# EAGLE design parrot_v2 (EAGLE 9.6.2)
CNAME: Parrot Teensy Board; CREVISION: 1.0; DESIGNER: Nathan Villicana-Shaw
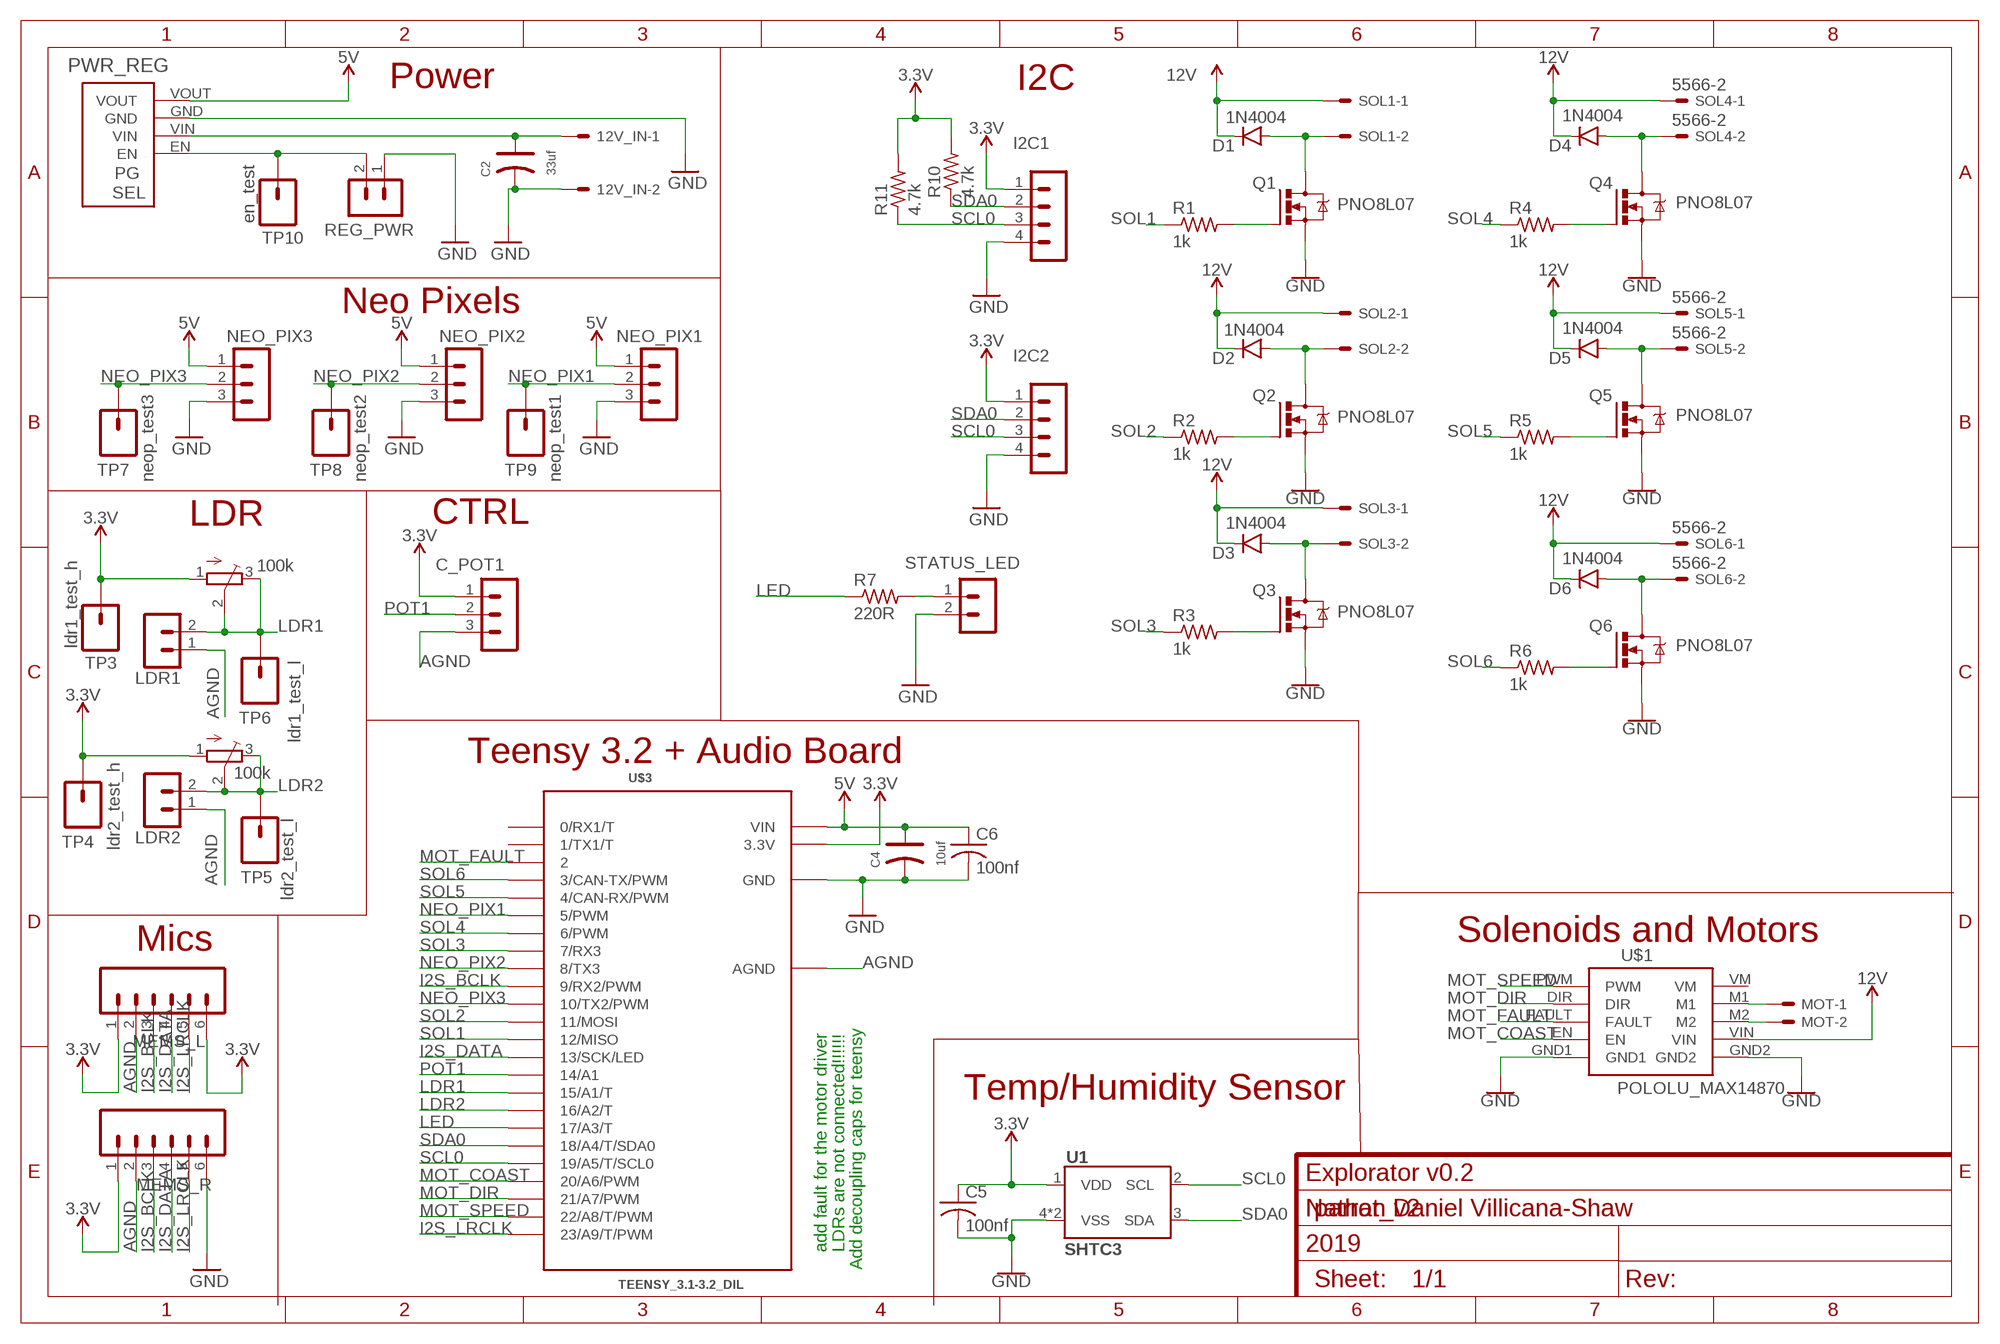
[diagram p0: schematic, sheet 1]

## Parts
12V_IN  5566-2  [5566-2]
C2  33uf  DIP-ALUMINUM-47UF-16V(D5-H7MM)  [PC-D5.3MM]
C4  10uf  DIP-ALUMINUM-47UF-16V(D5-H7MM)  [PC-D5.3MM]
C5  100nf  C-USC2012  [C2012]
C6  100nf  C-USC2012  [C2012]
C_POT1  B3B-PH-K  [B3B-PH-K]
D1  1N4004  DIODEPTH  [DIODE-1N4001]
D2  1N4004  DIODEPTH  [DIODE-1N4001]
D3  1N4004  DIODEPTH  [DIODE-1N4001]
D4  1N4004  DIODEPTH  [DIODE-1N4001]
D5  1N4004  DIODEPTH  [DIODE-1N4001]
D6  1N4004  DIODEPTH  [DIODE-1N4001]
I2C1  B4B-PH-K  [B4B-PH-K]
I2C2  B4B-PH-K  [B4B-PH-K]
LDR1  B2B-PH-K  [B2B-PH-K]
LDR2  B2B-PH-K  [B2B-PH-K]
MEMS_L  CONN_06POLAR  [MOLEX-1X6]
MEMS_R  CONN_06POLAR  [MOLEX-1X6]
MOT  5566-2  [5566-2]
NEO_PIX1  B3B-PH-K  [B3B-PH-K]
NEO_PIX2  B3B-PH-K  [B3B-PH-K]
NEO_PIX3  B3B-PH-K  [B3B-PH-K]
PWR_REG  S9V11F5S6CMA_MISSINIG_PINS  [S9V11F3S5CMA_MISSING_PINS]
Q1  PNO8L07  IRF540  [TO220BV]
Q2  PNO8L07  IRF540  [TO220BV]
Q3  PNO8L07  IRF540  [TO220BV]
Q4  PNO8L07  IRF540  [TO220BV]
Q5  PNO8L07  IRF540  [TO220BV]
Q6  PNO8L07  IRF540  [TO220BV]
R1  1k  R-US_M1206  [M1206]
R2  1k  R-US_M1206  [M1206]
R3  1k  R-US_M1206  [M1206]
R4  1k  R-US_M1206  [M1206]
R5  1k  R-US_M1206  [M1206]
R6  1k  R-US_M1206  [M1206]
R7  220R  R-US_M1206  [M1206]
R10  4.7k  R-US_M1206  [M1206]
R11  4.7k  R-US_M1206  [M1206]
REG_PWR  B2B-PH-K  [B2B-PH-K]
SOL1  5566-2  [5566-2]
SOL2  5566-2  [5566-2]
SOL3  5566-2  [5566-2]
SOL4  5566-2  [5566-2]
SOL5  5566-2  [5566-2]
SOL6  5566-2  [5566-2]
STATUS_LED  B2B-PH-K  [B2B-PH-K]
TM1  100k  TRIMPOTTC33X  [TC33X]
TM2  100k  TRIMPOTTC33X  [TC33X]
TP3  ldr1_test_h  CONN_01  [1X01]
TP4  ldr2_test_h  CONN_01  [1X01]
TP5  ldr2_test_l  CONN_01  [1X01]
TP6  ldr1_test_l  CONN_01  [1X01]
TP7  neop_test3  CONN_01  [1X01]
TP8  neop_test2  CONN_01  [1X01]
TP9  neop_test1  CONN_01  [1X01]
TP10  en_test  CONN_01  [1X01]
U1  SHTC3  [SHTC3]
U$1  POLOLU_MAX14870  [POLOLU_MAX14870]
U$3  TEENSY_3.1-3.2_DIL  [TEENSY_3.0-3.2&LC_DIL]

## Nets
3.3V [3.3V]: C5.1 C_POT1.1 I2C1.1 I2C2.1 MEMS_L.1 MEMS_L.6 MEMS_R.1 R10.2 R11.2 TM1.1(A) TM2.1(A) TP3.1 TP4.1 U1.1(VDD) U$3.3.3V
5V: C4.+ C6.1 NEO_PIX1.1 NEO_PIX2.1 NEO_PIX3.1 PWR_REG.VOUT U$3.VIN
12V [12V_IN]: 12V_IN.1 C2.+ D1.C D2.C D3.C D4.C D5.C D6.C PWR_REG.VIN SOL1.1 SOL2.1 SOL3.1 SOL4.1 SOL5.1 SOL6.1 U$1.VIN
AGND: C_POT1.3 LDR1.1 LDR2.1 MEMS_L.2 MEMS_R.2 U$3.AGND
GND: 12V_IN.2 C2.- C4.- C5.2 C6.2 I2C1.4 I2C2.4 MEMS_R.6 NEO_PIX1.3 NEO_PIX2.3 NEO_PIX3.3 PWR_REG.GND Q1.S Q2.S Q3.S Q4.S Q5.S Q6.S REG_PWR.1 STATUS_LED.2 U1.4(VSS) U1.5(VSS) U$1.GND1 U$1.GND2 U$3.GND
I2S_BCLK: MEMS_L.3 MEMS_R.3 U$3.9(9/RX2/PWM)
I2S_DATA: MEMS_L.4 MEMS_R.4 U$3.13(13/SCK/LED)
I2S_LRCLK: MEMS_L.5 MEMS_R.5 U$3.23/A9(23/A9/T/PWM)
LDR1: LDR1.2 TM1.2(S) TM1.3(E) TP6.1 U$3.15/A1(15/A1/T)
LDR2: LDR2.2 TM2.2(S) TM2.3(E) TP5.1 U$3.16/A2(16/A2/T)
LED: R7.1 U$3.17/A3(17/A3/T)
MOT_COAST: U$1.EN U$3.20/A6(20/A6/PWM)
MOT_DIR: U$1.DIR U$3.21/A7(21/A7/PWM)
MOT_FAULT: U$1.FAULT U$3.2
MOT_SPEED: U$1.PWM U$3.22/A8(22/A8/T/PWM)
N$1: Q5.G R5.2
N$2: D5.A Q5.D SOL5.2
N$4: Q6.G R6.2
N$5: Q2.G R2.2
N$6: D6.A Q6.D SOL6.2
N$7: R7.2 STATUS_LED.1
N$8: D2.A Q2.D SOL2.2
N$10: PWR_REG.EN REG_PWR.2 TP10.1
N$11: Q3.G R3.2
N$12: D3.A Q3.D SOL3.2
N$13: Q4.G R4.2
N$14: D4.A Q4.D SOL4.2
N$24: Q1.G R1.2
N$25: D1.A Q1.D SOL1.2
N$30: MOT.2 U$1.M2
N$31: MOT.1 U$1.M1
NEO_PIX1: NEO_PIX1.2 TP9.1 U$3.5(5/PWM)
NEO_PIX2: NEO_PIX2.2 TP8.1 U$3.8(8/TX3)
NEO_PIX3: NEO_PIX3.2 TP7.1 U$3.10(10/TX2/PWM)
POT1: C_POT1.2 U$3.14/A0(14/A1)
SCL0: I2C1.3 I2C2.3 R11.1 U1.2(SCL) U$3.19/A5(19/A5/T/SCL0)
SDA0: I2C1.2 I2C2.2 R10.1 U1.3(SDA) U$3.18/A4(18/A4/T/SDA0)
SOL1: R1.1 U$3.12(12/MISO)
SOL2: R2.1 U$3.11(11/MOSI)
SOL3: R3.1 U$3.7(7/RX3)
SOL4: R4.1 U$3.6(6/PWM)
SOL5: R5.1 U$3.4(4/CAN-RX/PWM)
SOL6: R6.1 U$3.3(3/CAN-TX/PWM)
Unconnected: U$1.VM U$3.0(0/RX1/T) U$3.1(1/TX1/T)

## Notes on the sheet
- Power | I2C
- Neo Pixels
- LDR | CTRL
- Teensy 3.2 + Audio Board
- Solenoids and Motors
- Mics
- Temp/Humidity Sensor
- Explorator v0.2
- Nathan Daniel Villicana-Shaw
- add fault for the motor driver | LDRs are not connected!!!!!! | 2019
- Add decoupling caps for teensy

## Library data of the parts
12V_IN MOT SOL1-SOL6 = con-molex:5566-2: Mini FIT connector 2 pol Source: http://www.molex.com; MF: MOLEX; OC_FARNELL: 1822072; OC_NEWARK: unknown
C2 C4 = Seeed-Capacitor:DIP-ALUMINUM-47UF-16V(D5-H7MM): 302030033; MPN: KS 100uF/16V; VALUE: 100uf
C5 C6 = adafruit:C-US: CAPACITOR, American symbol
C_POT1 NEO_PIX1-NEO_PIX3 = con-jst-ph:B3B-PH-K: HEADER
D1-D6 = SparkFun-DiscreteSemi:DIODE: Diode These are standard reverse protection diodes and small signal diodes. SMA package can handle up to about 1A. SOD-323 can handle about 200mA. What the SOD-323 package when ordering, there are some mfgs out there that are 5-pin packages.
I2C1 I2C2 = con-jst-ph:B4B-PH-K: HEADER
LDR1 LDR2 REG_PWR STATUS_LED = con-jst-ph:B2B-PH-K: HEADER
MEMS_L MEMS_R = SparkFun-Connectors:CONN_06: Multi connection point. Often used as Generic Header-pin footprint for 0.1 inch spaced/style header connections On any of the 0.1 inch spaced packages, you can populate with these: Break Away Headers - Straight <https://www.sparkfun.com/products/116> (PRT-00116) Break Away Male Headers - Right Angle <https://www.sparkfun.com/products/553> (PRT-00553) Female Headers <https://www.sparkfun.com/products/115> (PRT-00115) Break Away Headers - Machine Pin <https://www.sparkfun.com/products/117> (PRT-00117) Break Away Female Headers - Swiss Machine Pin <https://www.sparkfun.com/products/743> (PRT-00743) Arduino Stackable Header - 6 Pin <https://www.sparkfun.com/products/9280> (PRT-09280) For SCREWTERMINALS and SPRING TERMINALS visit here: Screw Terimnals on SparkFun.com <https://www.sparkfun.com/search/results?term=Screw+Terminals> (5mm/3.5mm/2.54mm spacing) This device is also useful as a general connection point to wire up your design to another part of your project. Our various solder wires solder well into these plated through hole pads. Hook-Up Wire - Assortment (Stranded, 22 AWG) <https://www.sparkfun.com/products/11375> (PRT-11375) Hook-Up Wire - Assortment (Solid Core, 22 AWG) <https://www.sparkfun.com/products/11367> (PRT-11367) View the entire wire category on our website here <https://www.sparkfun.com/categories/141>
PWR_REG = nathans-custom-parts:S9V11F5S6CMA_MISSINIG_PINS
Q1-Q6 = transistor-power:IRF540: HEXFET Power MOSFET
R1-R7 R10 R11 = adafruit:R-US_: RESISTOR, American symbol
TM1 TM2 = adafruit:TRIMPOT: SMT trimmer potentiometer part number TC33X http://www.ladyada.net/library/eagle
TP3-TP10 = SparkFun-Connectors:CONN_01: Single connection point. Often used as Generic Header-pin footprint for 0.1 inch spaced/style header connections On any of the 0.1 inch spaced packages, you can populate with these: Break Away Headers - Straight <https://www.sparkfun.com/products/116> (PRT-00116) Break Away Male Headers - Right Angle <https://www.sparkfun.com/products/553> (PRT-00553) Female Headers <https://www.sparkfun.com/products/115> (PRT-00115) Break Away Headers - Machine Pin <https://www.sparkfun.com/products/117> (PRT-00117) Break Away Female Headers - Swiss Machine Pin <https://www.sparkfun.com/products/743> (PRT-00743) This device is also useful as a general connection point to wire up your design to another part of your project. Our various solder wires solder well into these plated through hole pads. Hook-Up Wire - Assortment (Stranded, 22 AWG) <https://www.sparkfun.com/products/11375> (PRT-11375) Hook-Up Wire - Assortment (Solid Core, 22 AWG) <https://www.sparkfun.com/products/11367> (PRT-11367) View the entire wire category on our website here <https://www.sparkfun.com/categories/141> Special notes: SMTSO-256-ET is a "flush mount" nut for a 4-40 screw. We mostly use this on specialty testbeds; it is a nice way to connect hardware to your PCB at an adjustable hieght. Also note, the SNAP packages are for using a snappable style connector. We sell a baggie of snaps and they are also used on two LilyPad designs: Snap Assortment - 30 pack (male and female) <https://www.sparkfun.com/products/11347> (DEV-11347) LilyPad Arduino SimpleSnap <https://www.sparkfun.com/products/10941> (DEV-10941) LilyPad SimpleSnap Protoboard <https://www.sparkfun.com/products/10940> (DEV-10940)
U1 = SHTC3:SHTC3
U$1 = nathans-custom-parts:POLOLU_MAX14870
U$3 = teensy_3_and_LC:TEENSY_3.1-3.2_DIL: Teensy 3.1 or 3.2 in a DIL Layout.

## Net classes
0 default: width 0.203 mm, drill 0.508 mm, clearance 0.203 mm
1 12V_IN: width 1.016 mm, drill 0.762 mm, clearance 0.305 mm
2 3.3V: width 0.305 mm, drill 0.508 mm, clearance 0.254 mm
3 5V: width 0.787 mm, drill 0.508 mm, clearance 0.381 mm

## Board
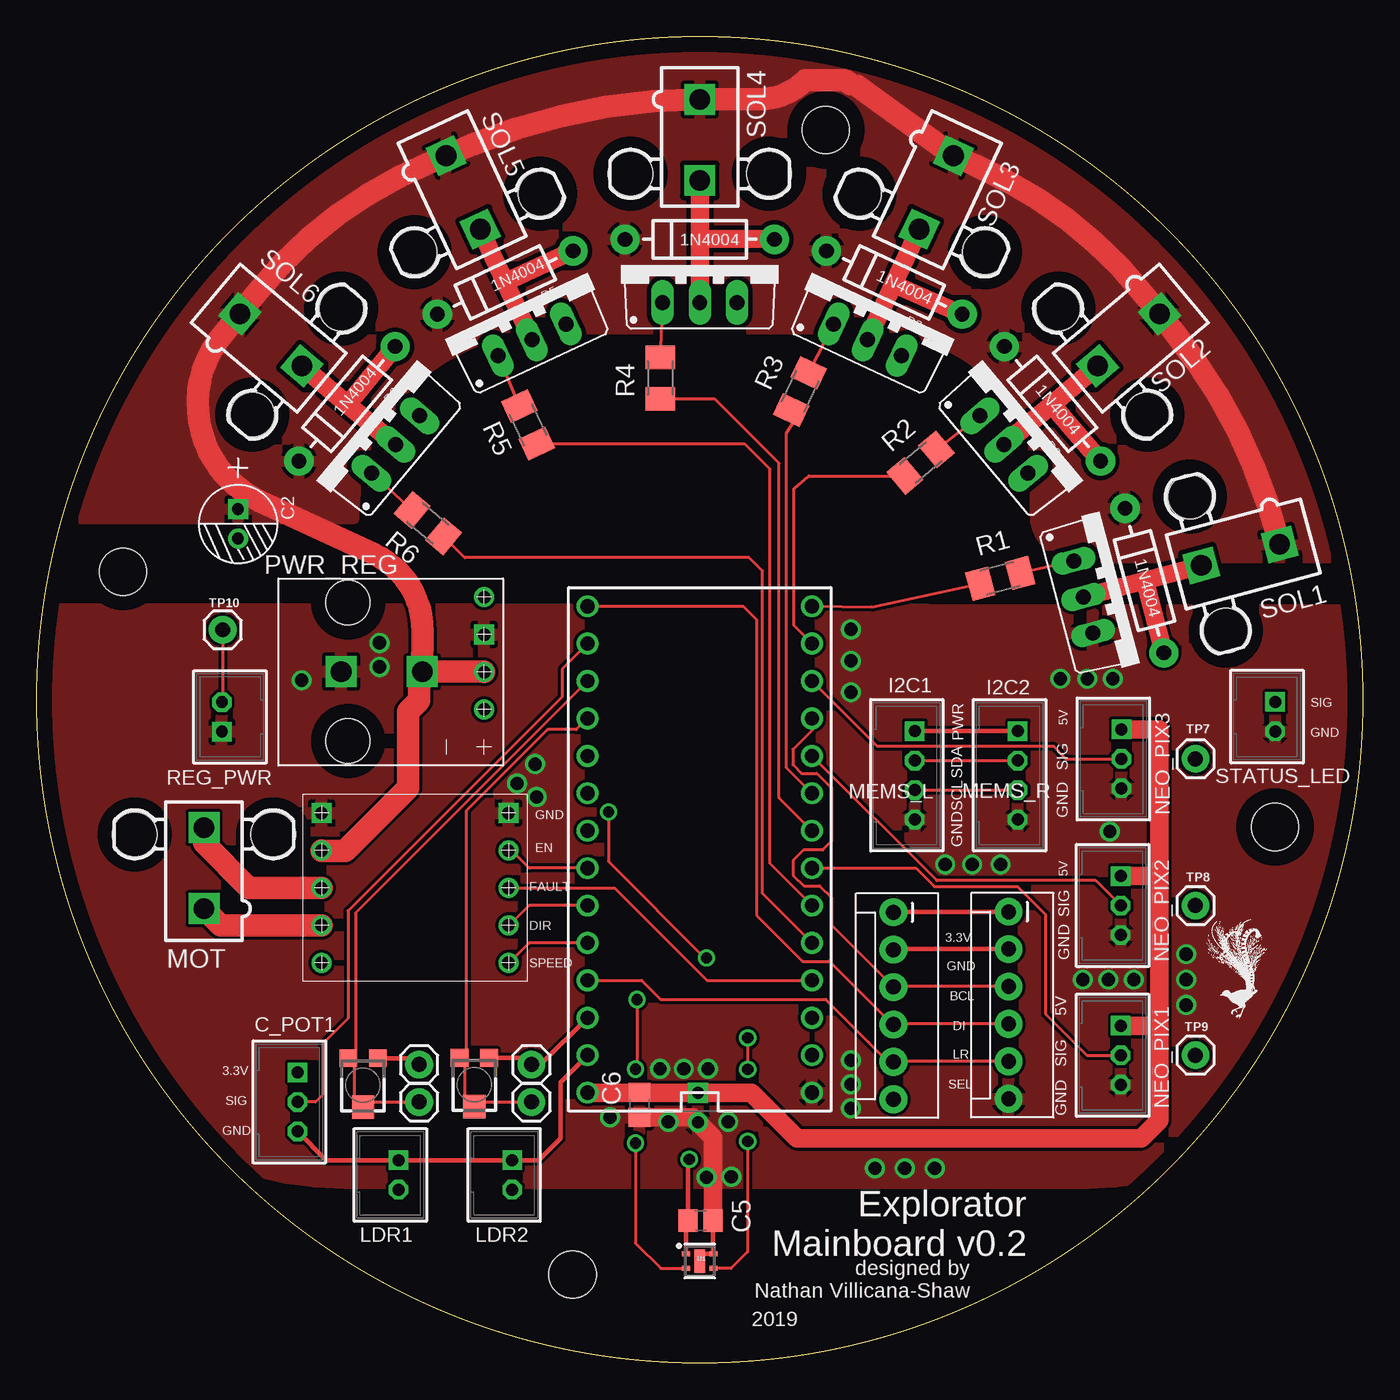
[diagram p1: board, top side]
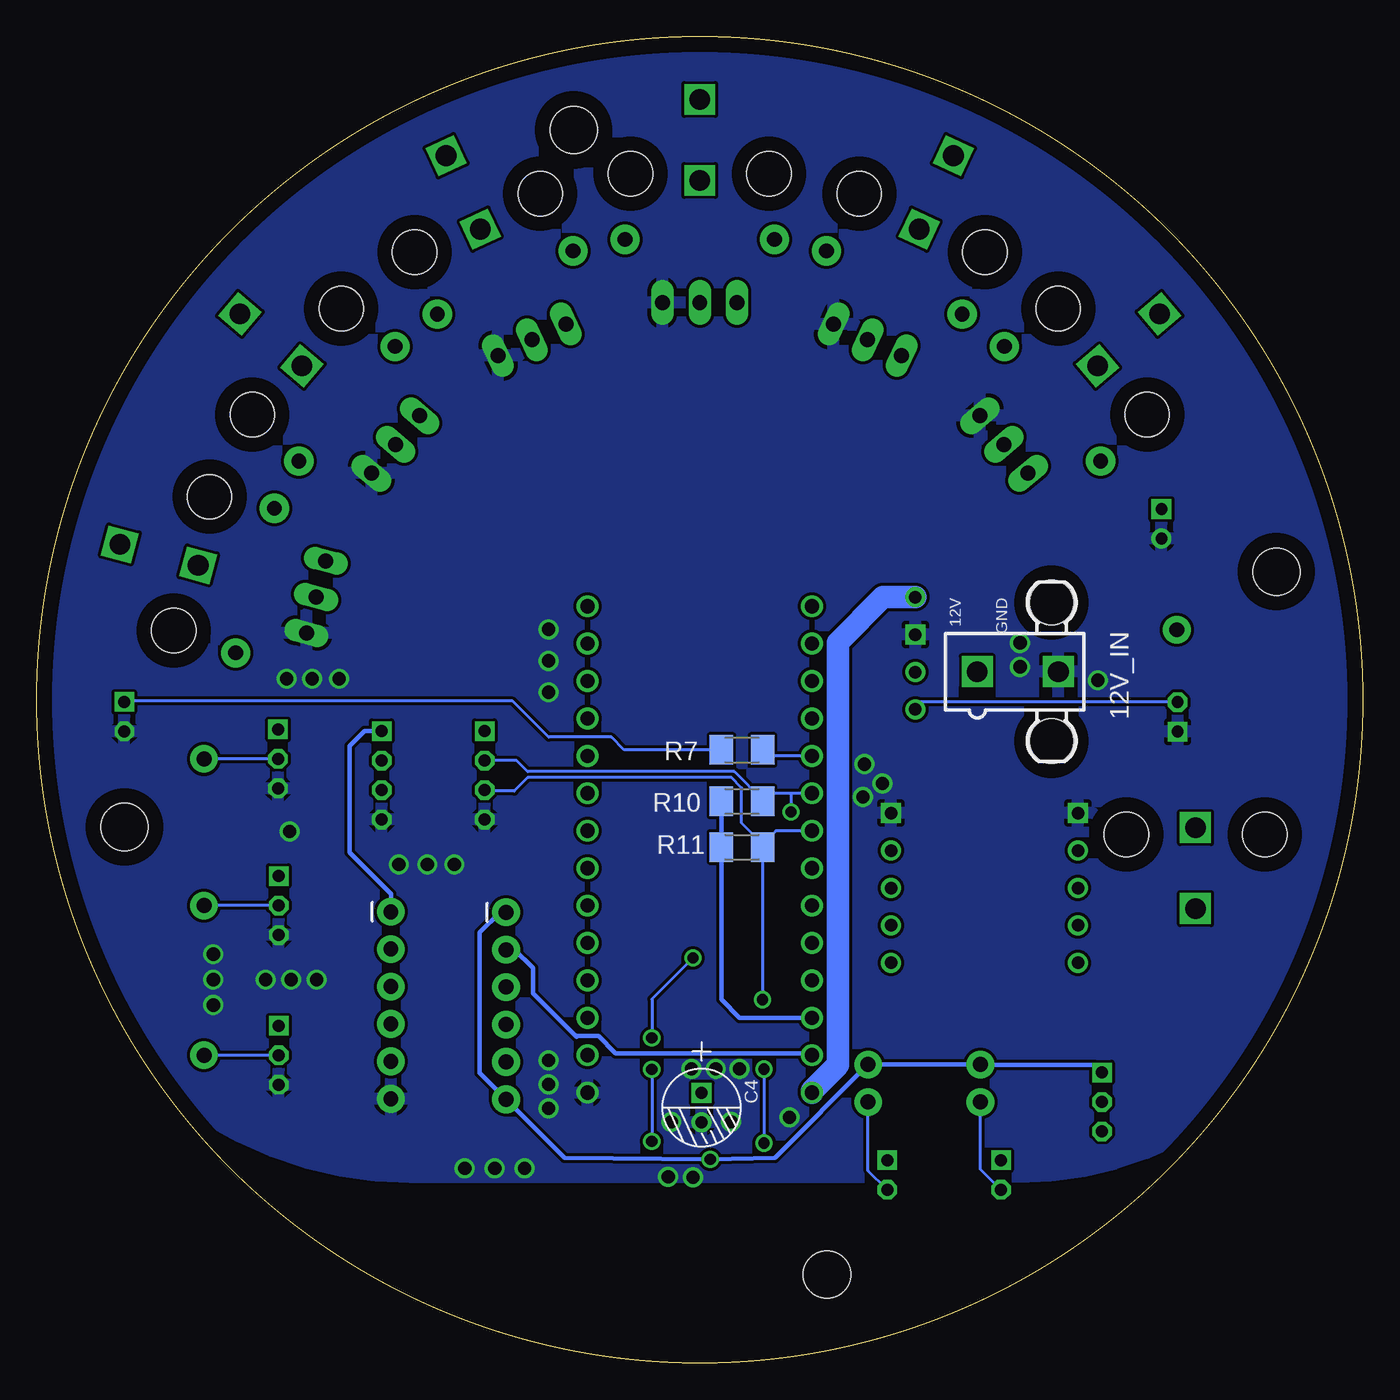
[diagram p2: board, bottom side, seen from below]

Size 90 x 90 mm. Coordinates in mm from the lower left corner, seen from the top.
Outline: circle at 45,45 radius 45
Copper layers (1*16): Top 0.035mm / dielectric 1.5mm / Bottom 0.035mm
Design rules "PCBway": minimum track width 6mil, minimum drill 0.3mm, track to track 0.205mm, track to pad 0.205mm, pad to pad 0.205mm, via to via 0.205mm, smd to smd 8mil, copper to edge 40mil, drill to drill 8mil, minimum pad ring 10mil, minimum via ring 8mil, stop-mask expansion 4mil, vias tented up to drill 25mil, thermal gap 10mil
Holes 3.2 mm at 5.86,53.7 36.37,5.99 84.05,36.37 53.56,83.68

### Footprints (pad centres in the part's own frame; a part is rotated, then mirrored left to right if it is on the bottom)
5566-2 = drill 1.4 square: 1 0,-2.75; 2 0,2.75 | hole 3: 4.7,2.29; -4.7,2.29
PC-D5.3MM = drill 0.8 pad 1.35 square: + -1,0 | drill 0.8 pad 1.35: - 1,0
C2012 = smd 1.3 x 1.5: 1 -0.85,0; 2 0.85,0
B3B-PH-K = drill 0.813 square: 1 -2,0 | drill 0.813 octagon: 2 0,0; 3 2,0
DIODE-1N4001 = drill 1 pad 1.981: A -5.08,0; C 5.08,0
B4B-PH-K = drill 0.813 square: 1 -3,0 | drill 0.813 octagon: 2 -1,0; 3 1,0; 4 3,0
B2B-PH-K = drill 0.813 square: 1 -1,0 | drill 0.813 octagon: 2 1,0
MOLEX-1X6 = drill 1.016 pad 1.88: 1 0,0; 2 2.54,0; 3 5.08,0; 4 7.62,0; 5 10.16,0; 6 12.7,0
S9V11F3S5CMA_MISSING_PINS = drill 0.85: EN 0,0; VIN 2.54,0; VOUT 7.62,0 | drill 0.85 square: GND 5.08,0
TO220BV = drill 1.016 long: D 0,-2.54; G -2.54,-2.54; S 2.54,-2.54
M1206 = smd 1.6 x 2: 1 -1.4,0; 2 1.4,0
TC33X = smd 1.2 x 1.2: 1 -1,-1.825; 3 1,-1.825 | smd 1.5 x 1.6: 2 0,1.5
1X01 = drill 1.016 pad 1.88: 1 0,0
SHTC3 = smd 0.55 x 0.35: 1 -0.925,0.5; 2 -0.925,-0.5; 3 0.925,-0.5; 4 0.925,0.5 | smd 0.7 x 1.6: 5 0,0
POLOLU_MAX14870 = drill 0.85: DIR 1.27,8.89; EN 1.27,3.81; FAULT 1.27,6.35; M1 13.97,8.89; M2 13.97,6.35; PWM 1.27,11.43; VIN 13.97,3.81; VM 13.97,11.43 | drill 0.85 square: GND1 1.27,1.27; GND2 13.97,1.27
TEENSY_3.0-3.2&LC_DIL = drill 0.965: 0 -7.62,13.97; 1 -7.62,11.43; 2 -7.62,8.89; 3 -7.62,6.35; 3.3V 7.62,11.43; 4 -7.62,3.81; 5 -7.62,1.27; 6 -7.62,-1.27; 7 -7.62,-3.81; 8 -7.62,-6.35; 9 -7.62,-8.89; 10 -7.62,-11.43; 11 -7.62,-13.97; 12 -7.62,-16.51; 13 7.62,-16.51; 14/A0 7.62,-13.97; 15/A1 7.62,-11.43; 16/A2 7.62,-8.89; 17/A3 7.62,-6.35; 18/A4 7.62,-3.81; 19/A5 7.62,-1.27; 20/A6 7.62,1.27; 21/A7 7.62,3.81; 22/A8 7.62,6.35; 23/A9 7.62,8.89; AGND 7.62,13.97; GND -7.62,16.51; VIN 7.62,16.51

### Placement (x,y rotation side)
12V_IN  23.41,46.91 270 bottom
C2  13.66,56.94 270 top
C4  44.87,17.31 270 bottom
C5  45.05,9.64 0 top
C6  40.91,17.49 270 top
C_POT1  17.7,17.7 270 top
D1  75.19,53.09 105 top
D2  68.94,65.09 130 top
D3  58.21,73.32 155 top
D4  45,76.25 180 top
D5  31.79,73.32 205 top
D6  21.06,65.09 230 top
I2C1  59.61,39.87 270 top
I2C2  66.59,39.87 270 top
LDR1  24.55,12.74 270 top
LDR2  32.27,12.74 270 top
MEMS_L  58.15,30.57 270 top
MEMS_R  65.97,30.61 270 top
MOT  11.34,33.57 0 top
NEO_PIX1  73.58,20.87 270 top
NEO_PIX2  73.58,31.03 270 top
NEO_PIX3  73.63,40.98 270 top
PWR_REG  30.37,44.34 90 top
Q1  73.49,52.64 285 top
Q2  67.6,63.96 310 top
Q3  57.47,71.74 335 top
Q4  45,74.5 0 top
Q5  32.53,71.74 25 top
Q6  22.4,63.96 50 top
R1  65.4,53.24 15 top
R2  60,61.09 40 top
R3  51.8,65.92 65 top
R4  42.32,66.84 90 top
R5  33.34,63.66 115 top
R6  26.55,56.98 140 top
R7  42.13,41.6 180 bottom
R10  42.13,38.1 180 bottom
R11  42.13,35 180 bottom
REG_PWR  12.56,43.83 90 top
SOL1  81.71,54.84 105 top
SOL2  74.11,69.43 130 top
SOL3  61.06,79.44 155 top
SOL4  45,83 180 top
SOL5  28.94,79.44 205 top
SOL6  15.89,69.43 230 top
STATUS_LED  84.07,43.86 270 top
TM1  22.14,18.84 180 top
TM2  29.7,18.87 180 top
TP3  33.57,20.23 180 top
TP4  25.95,20.23 180 top
TP5  33.57,17.7 180 top
TP6  25.95,17.7 180 top
TP7  78.66,40.99 0 top
TP8  78.66,31.03 0 top
TP9  78.66,20.87 0 top
TP10  12.62,49.75 0 top
U1  45,6.9 0 top
U$1  33.29,38.57 180 top
U$3  45,34.84 180 top

### Tracks (layer width: path | path; a pad name or v marks a point on that pad's centre or on a via)
3.3V  (via drill 0.76)
  Top 0.305: MEMS_R.1 58.19,30.61 MEMS_L.1 | I2C1.1 I2C2.1 | I2C2.1 | U$3.3.3V 34.2,20.23 33.72,20.23 | 33.72,20.23 TP3.1 | TM2.1 33.26,20.7 33.72,20.23 | TM1.1 25.52,20.66 TP4.1 | v44.29,13.81 44.19,13.71 44.19,11.36 44.2,11.35 C5.1 44.08,9.52 U1.1
  Bottom 0.305: MEMS_R.1 65.97,31.83 68.77,34.64 68.77,41.85 67.75,42.87 I2C2.1 | C_POT1.1 18.2,20.2 25.92,20.2 TP4.1 TP3.1 39.89,13.91 v44.29,13.81 54.18,13.91 MEMS_L.6 59.94,19.66 59.94,29.2 58.56,30.57 MEMS_L.1 | U$3.3.3V 42.3,23.41 43.53,24.65 R11.2 R10.2
5V
  Top 1.27: U$3.VIN C6.1 | C6.1 44.89,18.33 | 76.19,22.75 76.19,16.45 74.97,15.23 51.6,15.23 48.51,18.33 44.89,18.33 | 76.19,22.75 76.19,33.11 | 76.19,33.11 76.19,42.97 76.17,42.98 NEO_PIX3.1 | NEO_PIX2.1 76.11,33.03 76.19,33.11 | NEO_PIX1.1 76.07,22.87 76.19,22.75 | C6.1 | C4.+ 44.89,18.33
  Bottom 1.524: PWR_REG.VOUT 32.55,51.96 35.63,48.89 35.63,20.21 37.38,18.46 U$3.VIN
12V
  Top 1.27: U$1.VIN 19.35,34.74
  Top 1.524: SOL1.1 arc25 77.08,70.12 SOL2.1 73.55,74.36 arc23 63.62,81.32 SOL3.1 55.66,86.68 55.22,86.8 arc45 54.59,87.06 52.16,87.06 arc-45 49,85.75 SOL4.1 arc22 29.56,82.67 SOL5.1 26.89,81.56 arc29 15.02,72.72 SOL6.1 12.64,69.83 arc105 15.16,58.47 22.84,54.91 arc-66 26.19,49.62 12V_IN.1 | 12V_IN.1 30.33,46.91 PWR_REG.VIN | 12V_IN.1 25.96,46.7 25.96,44.94 25.94,44.94 25.21,44.21 25.21,39.03 20.92,34.74 19.35,34.74 U$1.VIN
  pour Top: 91.02,54.86 arc90 55.46,90.6 32.71,90.65 arc90 -0.62,57.29 21.53,57.29 arc-90 34.43,70.2 45.1,70.2 57.09,70.2 arc-90 67.76,59.53 67.76,57.6 arc90 70.7,54.65 90.82,54.65 arc90
AGND
  Top 0.305: MEMS_R.2 58.19,28.07 MEMS_L.2 | C_POT1.3 19.65,13.74 LDR1.1 LDR2.1 34.06,13.74 35.55,15.23 35.55,19.04 U$3.AGND
  Bottom 0.305: U$3.AGND 37.52,21.01 50.7,21.01 51.86,22.17 53.33,22.17 53.38,22.12 56.32,25.05 56.32,26.8 57.55,28.03 MEMS_L.2
GND  (via drill 0.9)
  Top 0.305: U1.5 45,7.41 45.01,7.4 U1.4 45.9,7.42 C5.2
  Top 1.27: C5.2 45.9,15.29 C4.- 44.55,16.64 C6.2
  other vias: 72.74,26 71.01,26 74.46,26 78.02,26 78.02,27.73 78.02,24.27 46.93,16.35 42.87,16.35 38.9,16.65 23.26,48.86 23.26,47.24 17.97,46.32 55.26,17.26 55.26,18.89 55.26,20.51 65.42,33.82 72.84,36.06 63.49,33.82 61.66,33.82 71.31,46.42 73.04,46.42 69.49,46.42 33.82,40.63 32.6,39.31 33.93,38.4 55.26,47.64 55.26,49.78 55.26,45.51 56.89,13.2 58.92,13.2 60.95,13.2 45.45,12.58 47.15,12.62 42.3,19.94 43.91,19.94 45.56,19.94
  pour Bottom: 64.63,12.62 23.37,12.62 arc-90 -0.72,36.7 -0.72,44.65 arc-90 45.35,90.72 arc-90 90.72,45.35 90.72,38.71 arc-90
  pour Top: 91.02,51.1 91.13,51.2 91.13,31.25 arc-45 85.69,18.13 arc-45 71.34,12.18 20.92,12.18 arc-45 4.97,18.79 arc-45 -0.39,31.78 -0.31,51.2
I2S_BCLK
  Top 0.203: U$3.9 52.62,42.93 51.32,41.63 51.32,40.61 51.92,40.01 52.95,40.01 53.94,39.02 53.94,35.4 53.34,34.79 52.05,34.79 51.34,34.08 51.34,33.09 52.06,32.37 53.14,32.37 53.92,31.58 53.92,29.72 MEMS_L.3 58.19,25.53 MEMS_R.3
I2S_DATA
  Top 0.203: MEMS_R.4 58.19,22.99 MEMS_L.4 58.09,22.95 53.8,27.24 51.98,27.24 48.86,30.37 48.86,50.44 47.95,51.35 U$3.13
I2S_LRCLK
  Top 0.203: MEMS_R.5 58.19,20.45 | 58.19,20.45 MEMS_L.5 | U$3.23/A9 41.05,25.95 42.34,24.67 53.54,24.67 56.45,21.75 56.45,21.74 57.74,20.45 58.19,20.45
LDR1
  Top 0.203: TP6.1 22.5,17.7 TM1.2 21.56,17.34 21.53,17.36 21.53,20.27 TM1.3 21.37,20.66 21.63,20.92 21.63,30.52 U$3.15/A1
  Bottom 0.203: LDR1.2 25.95,13.14 TP6.1
LDR2
  Top 0.203: TM2.3 28.76,20.63 | 28.76,20.63 29.05,20.34 29.05,17.36 TM2.2 30.02,17.7 TP5.1 | U$3.16/A2 36.62,42.97 34.66,42.97 29.15,37.46 29.15,21.02 28.76,20.63
  Bottom 0.203: LDR2.2 33.57,13.04 TP5.1
LED
  Bottom 0.203: U$3.17/A3 40.33,41.19 R7.1
MOT_COAST
  Top 0.203: U$3.20/A6 33.42,33.57 32.22,34.76 U$1.EN
MOT_DIR
  Top 0.203: U$3.21/A7 33.42,31.03 32.07,29.68 U$1.DIR
MOT_FAULT
  Top 0.203: U$1.FAULT 39.2,32.22 45.48,25.95 U$3.2
MOT_SPEED
  Top 0.203: U$3.22/A8 33.42,28.49 32.07,27.14 U$1.PWM
N$1
  Top 0.203: Q5.G R5.2
N$2
  Top 1.27: Q5.D 31.78,73.34 | 31.78,73.34 SOL5.2 | D5.A 31.78,73.34
N$4
  Top 0.203: Q6.G R6.2
N$5
  Top 0.203: Q2.G R2.2
N$6
  Top 1.27: Q6.D 21.11,65.04 | 21.11,65.04 SOL6.2 | D6.A 21.11,65.04
N$7
  Bottom 0.203: R7.2 50.13,41.6 50.99,42.46 55.26,42.46 57.7,44.9 84.02,44.9 STATUS_LED.1
N$8
  Top 1.27: Q2.D 68.89,65.04 | 68.89,65.04 SOL2.2 | D2.A 68.89,65.04
N$10
  Top 0.203: TP10.1 12.62,44.88 REG_PWR.2
  Bottom 0.203: REG_PWR.2 30.17,44.83 PWR_REG.EN
N$11
  Top 0.203: Q3.G R3.2
N$12
  Top 1.27: Q3.D 58.16,73.23 | 58.16,73.23 SOL3.2 | D3.A 58.16,73.23
N$13
  Top 0.203: Q4.G R4.2
N$14
  Top 1.27: Q4.D 45,76.29 | 45,76.29 SOL4.2 | D4.A 45,76.29
N$24
  Top 0.203: Q1.G R1.2
N$25
  Top 1.27: Q1.D 75.21,53.09 | 75.21,53.09 SOL1.2 | D1.A 75.21,53.09
N$30
  Top 1.524: U$1.M2 14.39,32.22 11.34,35.27 MOT.2
N$31
  Top 1.524: U$1.M1 12.48,29.68 MOT.1
NEO_PIX1
  Top 0.203: U$3.5 59.66,33.57 60.91,32.32 66.57,32.32 68.47,30.42 68.47,23.66 71.26,20.87 NEO_PIX1.2
  Bottom 0.203: NEO_PIX1.2 TP9.1
NEO_PIX2
  Top 0.203: U$3.8 61.09,32.73 71.88,32.73 NEO_PIX2.2
  Bottom 0.203: NEO_PIX2.2 TP8.1
NEO_PIX3
  Top 0.203: U$3.10 57.04,41.85 69,41.85 69.87,40.98 NEO_PIX3.2
  Bottom 0.203: NEO_PIX3.2 TP7.1
POT1
  Top 0.203: U$3.14/A0 35.65,47.08 35.65,45.2 21.12,30.67 21.12,23.36 19.4,21.63 19.4,18.18 18.91,17.7 C_POT1.2
SCL0  (via drill 0.76)
  Top 0.203: I2C1.3 I2C2.3 | v40.74,24.64 40.74,20.21 40.63,20.11 v40.63,19.93 | v40.63,14.9 40.63,8.12 42.36,6.39 U1.2
  Bottom 0.203: U$3.19/A5 39.83,36.11 40.73,35.2 | 40.73,35.2 R11.1 v40.73,24.64 v40.74,24.64 | 40.73,35.2 42.16,36.62 42.16,39.03 42.84,39.72 56.69,39.72 57.6,38.8 59.54,38.8 I2C1.3 | v40.63,19.93 v40.63,14.9
SDA0  (via drill 0.76)
  Top 0.203: I2C1.2 I2C2.2 | v38.8,37.38 38.8,34.03 45.41,27.42 v45.46,27.47 | v48.25,22.04 v48.25,19.91 | v48.25,15.03 48.25,7.51 47.13,6.39 U1.3
  Bottom 0.203: U$3.18/A4 38.8,38.65 | 38.8,38.65 40.19,38.65 R10.1 40.73,38.2 42.65,40.12 56.68,40.12 57.43,40.87 I2C1.2 | 38.8,38.65 v38.8,37.38 | v45.46,27.47 48.25,24.68 v48.25,22.04 | v48.25,19.91 v48.25,15.03
SOL1
  Top 0.203: U$3.12 56.68,51.3 R1.1
SOL2
  Top 0.203: U$3.11 51.4,50.03 51.4,59.34 52.39,60.19 R2.1
SOL3
  Top 0.203: U$3.7 50.89,40.38 50.89,63.09 51.66,64.33 R3.1
SOL4
  Top 0.203: U$3.6 50.38,38.34 50.38,61.05 46,65.44 R4.1
SOL5
  Top 0.203: U$3.4 49.77,33.88 49.77,60.65 48.03,62.39 R5.1
SOL6
  Top 0.203: R6.1 29.05,54.65 48.35,54.65 49.27,53.74 49.27,31.84 U$3.3

### Text on the board
tNames: PWR | SIG | 5V | SDA | GND | SCL | SIG | GND | GND | GND | EN | 5V | FAULT | SIG | DIR | 3.3V | SPEED | GND | GND | BCL | 5V | DI | LR | SIG | 3.3V | SEL | SIG | GND | GND | Explorator / Mainboard v0.2 | designed by / Nathan Villicana-Shaw | 2019
bNames: GND | 12V
tValues: 3.3V